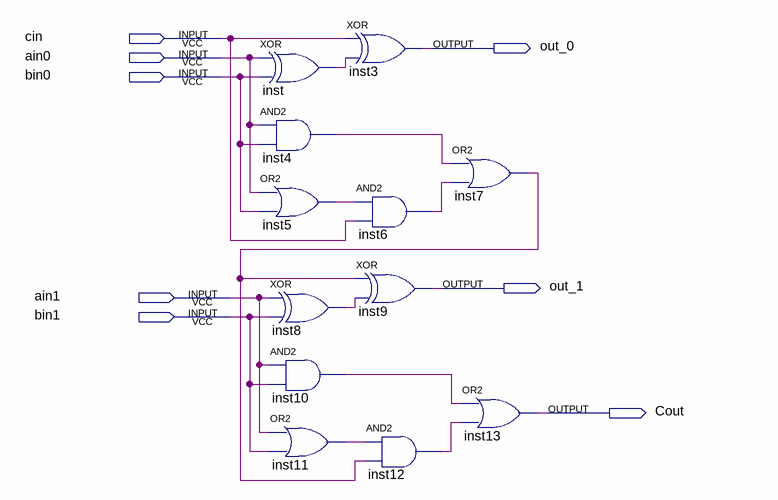
[diagram p0: schematic sheet]
// Quartus schematic somador.bdf as structural Verilog: 12 symbols, 8 pins
module somador (
  input  cin,
  input  ain0,
  input  bin0,
  input  ain1,
  input  bin1,
  output out_0,
  output out_1,
  output Cout
);

  wire inst4_out, inst5_out, inst6_out, inst7_out, inst8_out, inst10_out, inst11_out, inst12_out, inst_out;

  xor inst (inst_out, ain0, bin0);
  and inst4 (inst4_out, ain0, bin0);
  or inst5 (inst5_out, ain0, bin0);
  xor inst8 (inst8_out, ain1, bin1);
  and inst10 (inst10_out, ain1, bin1);
  or inst11 (inst11_out, ain1, bin1);
  xor inst3 (out_0, cin, inst_out);
  and inst6 (inst6_out, inst5_out, cin);
  xor inst9 (out_1, inst7_out, inst8_out);
  and inst12 (inst12_out, inst11_out, inst7_out);
  or inst7 (inst7_out, inst4_out, inst6_out);
  or inst13 (Cout, inst10_out, inst12_out);
endmodule
